# Altium schematic sheet LPC8N04demoVB.SchDoc
size 297 x 209 mm
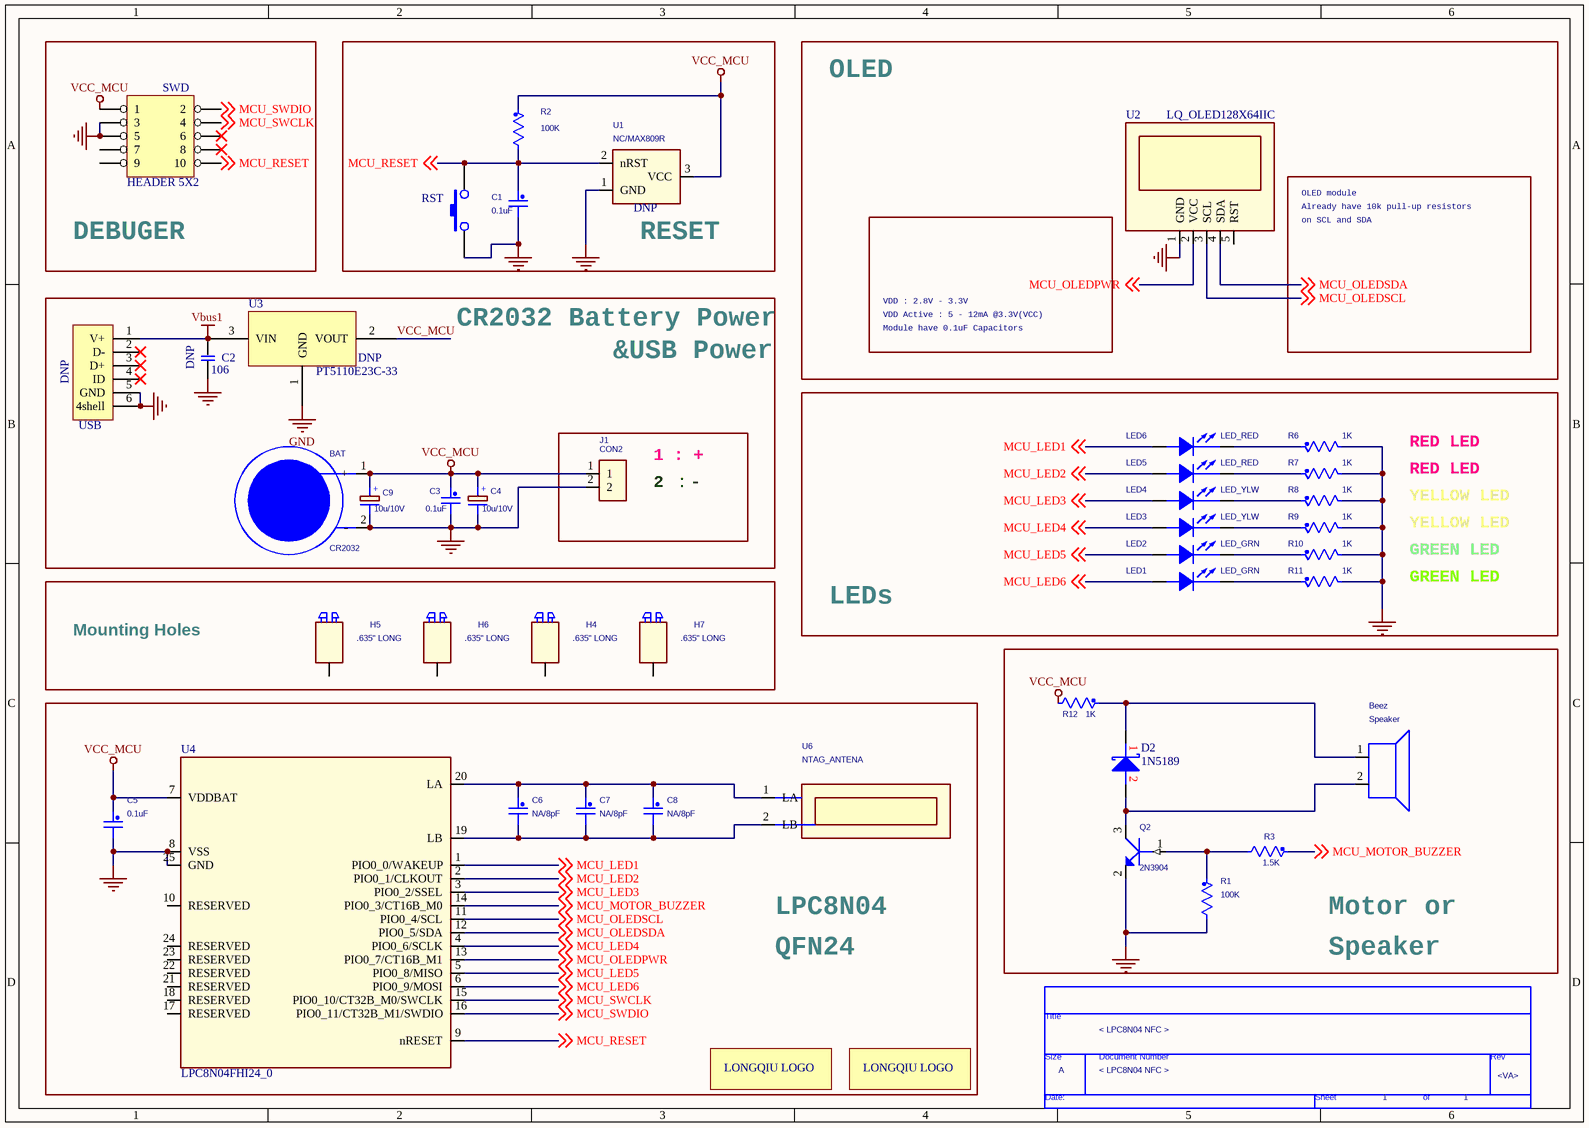
[diagram p0: LPC8N04demoVB.SchDoc]

## Parts
*  Doc: < LPC8N04 NFC >  RevCode: <VA>  Page Size: A  Page Number: 1  (hidden comment: TitleBlock0)  (graphical)
BAT  CR2032  [LQ_CR2032]
Beez  Speaker  [LQ_SPK5025]
C1  0.1uF  [LQ_C0603]
C2  106  [LQ_C1206T]
C3  0.1uF  [LQ_C0603]
C4  10u/10V  [LQ_C1206T]
C5  0.1uF  [LQ_C0603]
C6  NA/8pF  [LQ_C0603]
C7  NA/8pF  [LQ_C0603]
C8  NA/8pF  [LQ_C0603]
C9  10u/10V  [LQ_C0603]
D2  1N5189  [LQ_D1206Z]
H4  .635" LONG  [LQ_SCROW3&5MM]
H5  .635" LONG  [LQ_SCROW3&5MM]
H6  .635" LONG  [LQ_SCROW3&5MM]
H7  .635" LONG  [LQ_SCROW3&5MM]
J1  CON2  [LQ_SIP2]
LED1  LED_GRN  [LQ_LED3-2.54-GREEN]
LED2  LED_GRN  [LQ_LED3-2.54-GREEN]
LED3  LED_YLW  [LQ_LED3-2.54-YELLOW]
LED4  LED_YLW  [LQ_LED3-2.54-YELLOW]
LED5  LED_RED  [LQ_LED3-2.54-RED]
LED6  LED_RED  [LQ_LED3-2.54-RED]
LQ  LOGO  [LOGO5X8MM]  (value not drawn)
LQ1  LOGO  [NXPlogo35X81mm]  (value not drawn)
Q2  2N3904  [LQ_SOT-23NPN]
R1  100K  [LQ_R0603]
R2  100K  [LQ_R0603]
R3  1.5K  [LQ_R0603]
R6  1K  [LQ_R0603]
R7  1K  [LQ_R0603]
R8  1K  [LQ_R0603]
R9  1K  [LQ_R0603]
R10  1K  [LQ_R0603]
R11  1K  [LQ_R0603]
R12  1K  [LQ_R0603]
RST  SW-PB  [LQ_BT2SMT]  (value not drawn)
SWD  HEADER 5X2  [LQ_JTAG5X2-1.27]
U1  NC/MAX809R  [LQ_SOT-23NPN]
U2  LQ_OLED128X64IIC  [LQ_OLED128x64IIC]
U3  PT5110E23C-33  [LQ_SOT-23NPN]
U4  LPC8N04FHI24_0  [LQ_HVQFN24]
U6  NTAG_ANTENA  [NFCClass3Ant3T-2]
USB  USB  [LQ_MICROUSB-5PIN]  (value not drawn)

## Blocks framed on the sheet
DEBUGER: SWD
RESET: C1 R2 RST U1
OLED: U2
LEDs: LED1-LED6 R6-R11
Mounting Holes: H4-H7

## Nets
GND: BAT.2(-) C1.2 C2.2 C3.2 C4.2 C5.2 C9.2 J1.2 Q2.2(EMITTER) R1.2 R6.2 R7.2 R8.2 R9.2 R10.2 R11.2 RST.1 SWD.3 SWD.5 U1.1(GND) U2.1(GND) U3.1(GND) U4.8(VSS) U4.25(GND) USB.5(GND) USB.6(4shell)
Vbus1: C2.1 U3.3(VIN) USB.1(V+)
VCC_MCU: BAT.1(+) C3.1 C4.1 C5.1 C9.1 J1.1 R2.1 R12.2 SWD.1 U1.3(VCC) U3.2(VOUT) U4.7(VDDBAT)
MCU_LED1: LED6.1(ANODE) U4.1(PIO0_0/WAKEUP) ; off-sheet MCU_LED1
MCU_LED2: LED5.1(ANODE) U4.2(PIO0_1/CLKOUT) ; off-sheet MCU_LED2
MCU_LED3: LED4.1(ANODE) U4.3(PIO0_2/SSEL) ; off-sheet MCU_LED3
MCU_LED4: LED3.1(ANODE) U4.4(PIO0_6/SCLK) ; off-sheet MCU_LED4
MCU_LED5: LED2.1(ANODE) U4.5(PIO0_8/MISO) ; off-sheet MCU_LED5
MCU_LED6: LED1.1(ANODE) U4.6(PIO0_9/MOSI) ; off-sheet MCU_LED6
MCU_MOTOR_BUZZER: R3.1 U4.14(PIO0_3/CT16B_M0) ; off-sheet MCU_MOTOR_BUZZER
MCU_OLEDPWR: U2.2(VCC) U4.13(PIO0_7/CT16B_M1) ; off-sheet MCU_OLEDPWR
MCU_OLEDSCL: U2.3(SCL) U4.11(PIO0_4/SCL) ; off-sheet MCU_OLEDSCL
MCU_OLEDSDA: U2.4(SDA) U4.12(PIO0_5/SDA) ; off-sheet MCU_OLEDSDA
MCU_RESET: C1.1 R2.2 RST.2 SWD.10 U1.2(nRST) U4.9(nRESET) ; off-sheet MCU_RESET
MCU_SWCLK: SWD.4 U4.15(PIO0_10/CT32B_M0/SWCLK) ; off-sheet MCU_SWCLK
MCU_SWDIO: SWD.2 U4.16(PIO0_11/CT32B_M1/SWDIO) ; off-sheet MCU_SWDIO
NetBeez_1: Beez.1(A) D2.1 R12.1
NetBeez_2: Beez.2(B) D2.2 Q2.3(COLLECTOR)
NetC6_1: C6.1 C7.1 C8.1 U4.20(LA) U6.1(LA)
NetC6_2: C6.2 C7.2 C8.2 U4.19(LB) U6.2(LB)
NetLED1_2: LED1.2(CATHODE) R11.1
NetLED2_2: LED2.2(CATHODE) R10.1
NetLED3_2: LED3.2(CATHODE) R9.1
NetLED4_2: LED4.2(CATHODE) R8.1
NetLED5_2: LED5.2(CATHODE) R7.1
NetLED6_2: LED6.2(CATHODE) R6.1
NetQ2_1: Q2.1(BASE) R1.1 R3.2

Not connected (* = marked no-connect by the designer): H4 1(NC_1); H5 1(NC_1); H6 1(NC_1); H7 1(NC_1); SWD 6* 7 8* 9; U2 5(RST); U4 10(RESERVED) 17(RESERVED) 18(RESERVED) 21(RESERVED) 22(RESERVED) 23(RESERVED) 24(RESERVED); USB 2(D-)* 3(D+)* 4(ID)*

## Notes on the sheet
- OLED module
- (near U1) DNP
- Already have 10k pull-up resistors
- on SCL and SDA
- CR2032 Battery Power
- VDD : 2.8V - 3.3V
- VDD Active : 5 - 12mA @3.3V(VCC)
- Module have 0.1uF Capacitors
- (near USB) DNP
- (near C2) DNP
- (near U3) DNP
- &USB Power
- 1 : +
- RED LED
- 2 ：-
- YELLOW LED
- GREEN LED
- LPC8N04
- Motor or
- QFN24
- Speaker
- (in symbol CAP PN) +
- (in symbol LOGO) LONGQIU LOGO
- (in symbol TitleBlock0) Title; Size; Document Number; Rev; Date:; Sheet; of

## Library data of the parts
Beez = BUZZER_0
C1 C3 C5-C8 = C_Generic
C2 = LQ_CAP: CAP
C4 C9 = CAP PN: SDTSourceLibName: C:\WINDOWS\TEMP\SNDS.LIB
D2 = LQ_Z: Schottky Diode
H4 H6 = SPACER: FASTENER, STANDOFF 4.5MMX3.53XM3.0X0.5 ROUND THR .635"L BRASS; CLASS: IC; CAD_APPROVED: Yes; ASSY_OPT: DNP; MFG_PN01: MSS251-R-1-A-16; MFG_NAME01: UNICORP; AGILE_PN: 280-76498; HEIGHT: 16.13MM; ROHS: Yes
H5 H7 = SPACER: FASTENER, STANDOFF 4.5MMX3.53XM3.0X0.5 ROUND THR .635"L BRASS; CLASS: IC; AGILE_PN: 280-76498; MFG_NAME01: UNICORP; MFG_PN01: MSS251-R-1-A-16; ASSY_OPT: DNP; CAD_APPROVED: Yes; ROHS: Yes; HEIGHT: 16.13MM
LED1-LED6 = LED_DIP_0
Q2 = 2N3904_0
R1 R3 R12 = Register
R2 = R_Generic: Mfg #1: AVX; P/N #1: CR10-1001F-T; Watts: 0.1W; Toler.: 1%
R6-R11 = Register_Dup1
U1 = MAX809R
U2 = LQ_OLED128645IIC
U3 = AMS1117
USB = MINIUSB
* = TitleBlock0: Page Create Date: March  8, 1995; Title: < LPC8N04 NFC >; Page Count: 1